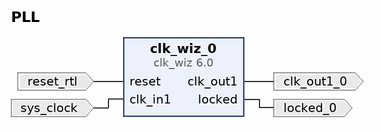
[diagram p0: block diagram of the top level]
# Vivado block design PLL, xc7z020clg400-1, Vivado 2018.3
create_bd_design PLL

create_bd_port -dir I -type rst reset_rtl
set_property -dict {CONFIG.POLARITY ACTIVE_HIGH} [get_bd_ports reset_rtl]
create_bd_port -dir I -type clk sys_clock
set_property -dict {CONFIG.FREQ_HZ 125000000 CONFIG.PHASE 0.000} [get_bd_ports sys_clock]
create_bd_port -dir O locked_0
create_bd_port -dir O -type clk clk_out1_0
set_property -dict {CONFIG.FREQ_HZ 180000000} [get_bd_ports clk_out1_0]

create_bd_cell -type ip -vlnv xilinx.com:ip:clk_wiz:6.0 clk_wiz_0
set_property -dict [list \
  CONFIG.CLKIN1_JITTER_PS 80.0 \
  CONFIG.CLKOUT1_DRIVES BUFG \
  CONFIG.CLKOUT1_JITTER 215.496 \
  CONFIG.CLKOUT1_PHASE_ERROR 249.865 \
  CONFIG.CLKOUT1_REQUESTED_OUT_FREQ 180.000 \
  CONFIG.CLKOUT2_DRIVES BUFG \
  CONFIG.CLKOUT3_DRIVES BUFG \
  CONFIG.CLKOUT4_DRIVES BUFG \
  CONFIG.CLKOUT5_DRIVES BUFG \
  CONFIG.CLKOUT6_DRIVES BUFG \
  CONFIG.CLKOUT7_DRIVES BUFG \
  CONFIG.CLK_IN1_BOARD_INTERFACE sys_clock \
  CONFIG.MMCM_CLKFBOUT_MULT_F 36 \
  CONFIG.MMCM_CLKIN1_PERIOD 8.000 \
  CONFIG.MMCM_CLKIN2_PERIOD 10.0 \
  CONFIG.MMCM_CLKOUT0_DIVIDE_F 5 \
  CONFIG.MMCM_COMPENSATION ZHOLD \
  CONFIG.MMCM_DIVCLK_DIVIDE 5 \
  CONFIG.PRIMITIVE PLL \
  CONFIG.USE_BOARD_FLOW true \
] [get_bd_cells clk_wiz_0]

# ---- connections ----

connect_bd_net [get_bd_ports reset_rtl] [get_bd_pins clk_wiz_0/reset]
connect_bd_net [get_bd_ports sys_clock] [get_bd_pins clk_wiz_0/clk_in1]
connect_bd_net [get_bd_pins clk_wiz_0/locked] [get_bd_ports locked_0]
connect_bd_net [get_bd_pins clk_wiz_0/clk_out1] [get_bd_ports clk_out1_0]

validate_bd_design
save_bd_design
